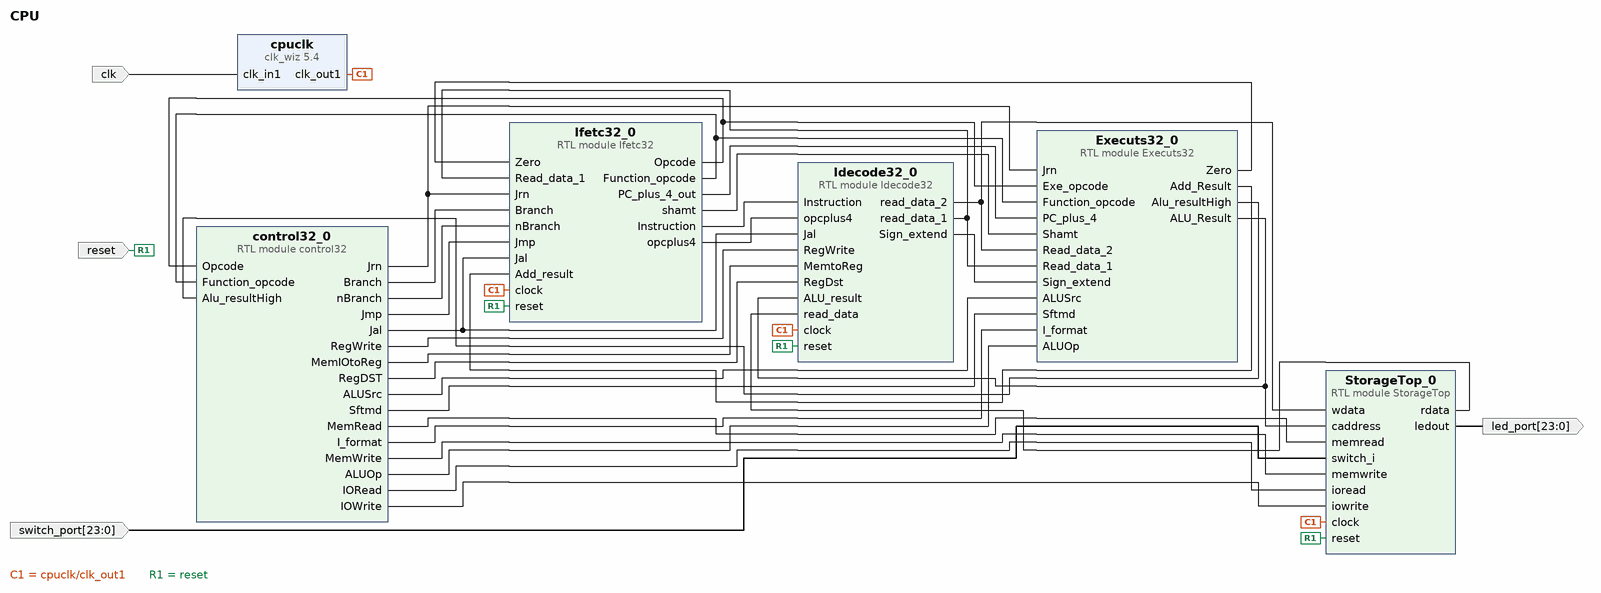
[diagram p0: block diagram of the top level]
# Vivado block design CPU, xc7a100tfgg484-1, Vivado 2017.4
create_bd_design CPU

create_bd_port -dir I reset
create_bd_port -dir I -from 23 -to 0 switch_port
create_bd_port -dir O -from 23 -to 0 led_port
create_bd_port -dir I clk

create_bd_cell -type ip -vlnv xilinx.com:ip:clk_wiz:5.4 cpuclk
set_property -dict [list \
  CONFIG.PRIMITIVE PLL \
  CONFIG.CLKOUT1_REQUESTED_OUT_FREQ 23.000 \
  CONFIG.CLKOUT1_DRIVES BUFG \
  CONFIG.CLKOUT2_DRIVES BUFG \
  CONFIG.CLKOUT3_DRIVES BUFG \
  CONFIG.CLKOUT4_DRIVES BUFG \
  CONFIG.CLKOUT5_DRIVES BUFG \
  CONFIG.CLKOUT6_DRIVES BUFG \
  CONFIG.CLKOUT7_DRIVES BUFG \
  CONFIG.USE_LOCKED false \
  CONFIG.USE_RESET false \
  CONFIG.MMCM_DIVCLK_DIVIDE 5 \
  CONFIG.MMCM_CLKFBOUT_MULT_F 46 \
  CONFIG.MMCM_COMPENSATION ZHOLD \
  CONFIG.MMCM_CLKOUT0_DIVIDE_F 40 \
  CONFIG.CLKOUT1_JITTER 342.117 \
  CONFIG.CLKOUT1_PHASE_ERROR 303.235 \
] [get_bd_cells cpuclk]
create_bd_cell -type module -reference Ifetc32 Ifetc32_0
create_bd_cell -type module -reference StorageTop StorageTop_0
create_bd_cell -type module -reference Idecode32 Idecode32_0
create_bd_cell -type module -reference control32 control32_0
create_bd_cell -type module -reference Executs32 Executs32_0

# ---- connections ----

connect_bd_net [get_bd_pins cpuclk/clk_out1] [get_bd_pins Ifetc32_0/clock] [get_bd_pins StorageTop_0/clock] [get_bd_pins Idecode32_0/clock]
connect_bd_net [get_bd_ports reset] [get_bd_pins Ifetc32_0/reset] [get_bd_pins StorageTop_0/reset] [get_bd_pins Idecode32_0/reset]
connect_bd_net [get_bd_pins Ifetc32_0/Instruction] [get_bd_pins Idecode32_0/Instruction]
connect_bd_net [get_bd_pins control32_0/Branch] [get_bd_pins Ifetc32_0/Branch]
connect_bd_net [get_bd_pins control32_0/nBranch] [get_bd_pins Ifetc32_0/nBranch]
connect_bd_net [get_bd_pins control32_0/Jmp] [get_bd_pins Ifetc32_0/Jmp]
connect_bd_net [get_bd_pins control32_0/Jal] [get_bd_pins Ifetc32_0/Jal] [get_bd_pins Idecode32_0/Jal]
connect_bd_net [get_bd_pins control32_0/Jrn] [get_bd_pins Ifetc32_0/Jrn] [get_bd_pins Executs32_0/Jrn]
connect_bd_net [get_bd_pins Executs32_0/Zero] [get_bd_pins Ifetc32_0/Zero]
connect_bd_net [get_bd_pins Executs32_0/Add_Result] [get_bd_pins Ifetc32_0/Add_result]
connect_bd_net [get_bd_pins Idecode32_0/read_data_1] [get_bd_pins Ifetc32_0/Read_data_1] [get_bd_pins Executs32_0/Read_data_1]
connect_bd_net [get_bd_pins Ifetc32_0/PC_plus_4_out] [get_bd_pins Executs32_0/PC_plus_4]
connect_bd_net [get_bd_pins Idecode32_0/read_data_2] [get_bd_pins StorageTop_0/wdata] [get_bd_pins Executs32_0/Read_data_2]
connect_bd_net [get_bd_pins Idecode32_0/Sign_extend] [get_bd_pins Executs32_0/Sign_extend]
connect_bd_net [get_bd_ports switch_port] [get_bd_pins StorageTop_0/switch_i]
connect_bd_net [get_bd_pins StorageTop_0/ledout] [get_bd_ports led_port]
connect_bd_net [get_bd_pins StorageTop_0/rdata] [get_bd_pins Idecode32_0/read_data]
connect_bd_net [get_bd_pins Executs32_0/ALU_Result] [get_bd_pins StorageTop_0/caddress] [get_bd_pins Idecode32_0/ALU_result]
connect_bd_net [get_bd_pins control32_0/RegWrite] [get_bd_pins Idecode32_0/RegWrite]
connect_bd_net [get_bd_pins control32_0/MemIOtoReg] [get_bd_pins Idecode32_0/MemtoReg]
connect_bd_net [get_bd_pins control32_0/RegDST] [get_bd_pins Idecode32_0/RegDst]
connect_bd_net [get_bd_pins Ifetc32_0/opcplus4] [get_bd_pins Idecode32_0/opcplus4]
connect_bd_net [get_bd_pins control32_0/MemRead] [get_bd_pins StorageTop_0/memread]
connect_bd_net [get_bd_pins control32_0/MemWrite] [get_bd_pins StorageTop_0/memwrite]
connect_bd_net [get_bd_pins control32_0/IORead] [get_bd_pins StorageTop_0/ioread]
connect_bd_net [get_bd_pins control32_0/IOWrite] [get_bd_pins StorageTop_0/iowrite]
connect_bd_net [get_bd_pins control32_0/ALUSrc] [get_bd_pins Executs32_0/ALUSrc]
connect_bd_net [get_bd_pins control32_0/Sftmd] [get_bd_pins Executs32_0/Sftmd]
connect_bd_net [get_bd_pins control32_0/I_format] [get_bd_pins Executs32_0/I_format]
connect_bd_net [get_bd_pins control32_0/ALUOp] [get_bd_pins Executs32_0/ALUOp]
connect_bd_net [get_bd_pins Ifetc32_0/Opcode] [get_bd_pins control32_0/Opcode] [get_bd_pins Executs32_0/Exe_opcode]
connect_bd_net [get_bd_pins Ifetc32_0/Function_opcode] [get_bd_pins control32_0/Function_opcode] [get_bd_pins Executs32_0/Function_opcode]
connect_bd_net [get_bd_pins Executs32_0/Alu_resultHigh] [get_bd_pins control32_0/Alu_resultHigh]
connect_bd_net [get_bd_ports clk] [get_bd_pins cpuclk/clk_in1]
connect_bd_net [get_bd_pins Ifetc32_0/shamt] [get_bd_pins Executs32_0/Shamt]

validate_bd_design
save_bd_design
